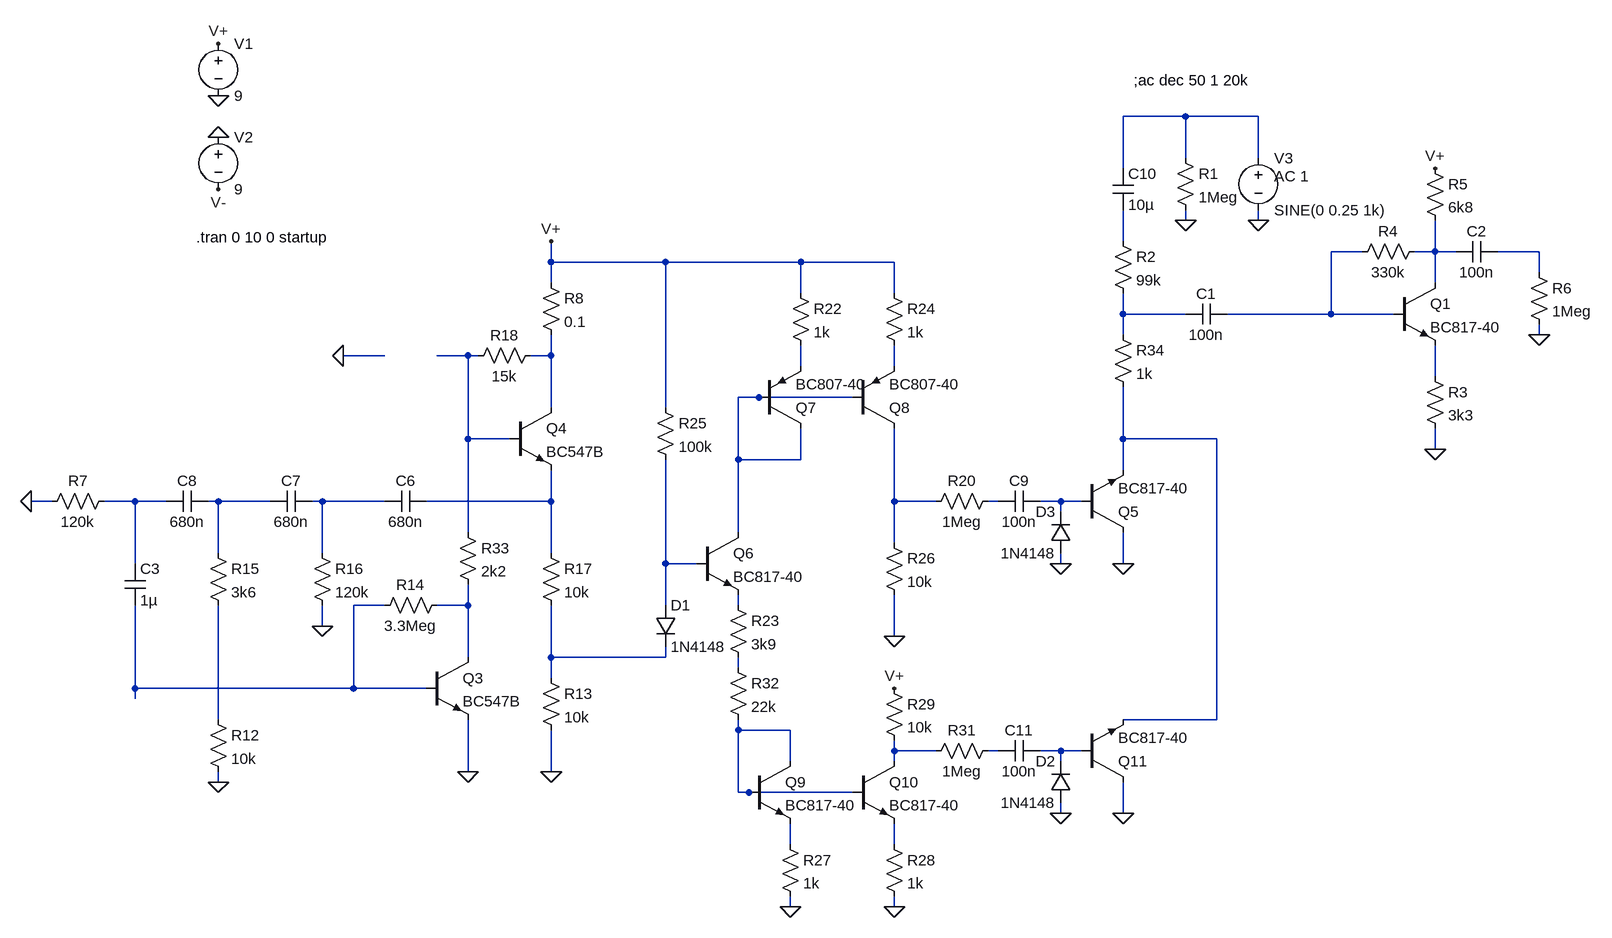
[diagram p0: schematic Draft15.asc]
Draft15.asc, the LTspice schematic file:
Version 4
SHEET 1 4440 680
WIRE 3808 -704 3712 -704
WIRE 3920 -704 3808 -704
WIRE 3808 -640 3808 -704
WIRE 3920 -640 3920 -704
WIRE 3712 -624 3712 -704
WIRE 3808 -544 3808 -560
WIRE 3920 -544 3920 -560
WIRE 3712 -512 3712 -560
WIRE 4080 -496 4032 -496
WIRE 4192 -496 4192 -544
WIRE 4192 -496 4160 -496
WIRE 4224 -496 4192 -496
WIRE 4352 -496 4288 -496
WIRE 2832 -480 2832 -512
WIRE 3008 -480 2832 -480
WIRE 3216 -480 3008 -480
WIRE 3360 -480 3216 -480
WIRE 4352 -464 4352 -496
WIRE 2832 -448 2832 -480
WIRE 4192 -448 4192 -496
WIRE 3216 -432 3216 -480
WIRE 3360 -432 3360 -480
WIRE 3712 -400 3712 -432
WIRE 3808 -400 3712 -400
WIRE 4032 -400 4032 -496
WIRE 4032 -400 3872 -400
WIRE 4128 -400 4032 -400
WIRE 3712 -368 3712 -400
WIRE 4352 -368 4352 -384
WIRE 2576 -336 2512 -336
WIRE 2704 -336 2656 -336
WIRE 2720 -336 2704 -336
WIRE 2832 -336 2832 -368
WIRE 2832 -336 2800 -336
WIRE 3216 -320 3216 -352
WIRE 3360 -320 3360 -352
WIRE 4192 -304 4192 -352
WIRE 3152 -272 3120 -272
WIRE 3296 -272 3152 -272
WIRE 2832 -256 2832 -336
WIRE 3008 -256 3008 -480
WIRE 2704 -208 2704 -336
WIRE 2768 -208 2704 -208
WIRE 3712 -208 3712 -288
WIRE 3856 -208 3712 -208
WIRE 4192 -192 4192 -224
WIRE 3120 -176 3120 -272
WIRE 3216 -176 3216 -224
WIRE 3216 -176 3120 -176
WIRE 3712 -160 3712 -208
WIRE 2064 -112 2032 -112
WIRE 2192 -112 2144 -112
WIRE 2240 -112 2192 -112
WIRE 2320 -112 2304 -112
WIRE 2400 -112 2320 -112
WIRE 2480 -112 2464 -112
WIRE 2576 -112 2480 -112
WIRE 2832 -112 2832 -160
WIRE 2832 -112 2640 -112
WIRE 3360 -112 3360 -224
WIRE 3424 -112 3360 -112
WIRE 3520 -112 3504 -112
WIRE 3616 -112 3584 -112
WIRE 3648 -112 3616 -112
WIRE 3616 -96 3616 -112
WIRE 2704 -64 2704 -208
WIRE 3120 -64 3120 -176
WIRE 3360 -48 3360 -112
WIRE 2320 -32 2320 -112
WIRE 2480 -32 2480 -112
WIRE 2832 -32 2832 -112
WIRE 2192 -16 2192 -112
WIRE 3008 -16 3008 -176
WIRE 3056 -16 3008 -16
WIRE 3616 -16 3616 -32
WIRE 3712 -16 3712 -64
WIRE 2576 48 2528 48
WIRE 2704 48 2704 16
WIRE 2704 48 2656 48
WIRE 3008 48 3008 -16
WIRE 3120 48 3120 32
WIRE 2480 80 2480 48
WIRE 3360 96 3360 32
WIRE 2704 128 2704 48
WIRE 2832 128 2832 48
WIRE 3008 128 3008 112
WIRE 3008 128 2832 128
WIRE 3120 144 3120 128
WIRE 2832 160 2832 128
WIRE 2192 176 2192 48
WIRE 2528 176 2528 48
WIRE 2528 176 2192 176
WIRE 2640 176 2528 176
WIRE 2192 192 2192 176
WIRE 2320 224 2320 48
WIRE 3856 224 3856 -208
WIRE 3856 224 3712 224
WIRE 3120 240 3120 224
WIRE 3200 240 3120 240
WIRE 3360 272 3360 256
WIRE 3424 272 3360 272
WIRE 3520 272 3504 272
WIRE 3616 272 3584 272
WIRE 3648 272 3616 272
WIRE 3200 288 3200 240
WIRE 3360 288 3360 272
WIRE 3616 288 3616 272
WIRE 2704 304 2704 224
WIRE 2832 304 2832 240
WIRE 2320 320 2320 304
WIRE 3120 336 3120 240
WIRE 3136 336 3120 336
WIRE 3296 336 3136 336
WIRE 3616 368 3616 352
WIRE 3712 368 3712 320
WIRE 3200 416 3200 384
WIRE 3360 416 3360 384
WIRE 3200 512 3200 496
WIRE 3360 512 3360 496
FLAG 2320 -736 0
FLAG 2320 -672 0
FLAG 2320 -816 V+
FLAG 2320 -592 V-
FLAG 2704 304 0
FLAG 2480 80 0
FLAG 2320 320 0
FLAG 2832 304 0
FLAG 2832 -512 V+
FLAG 2512 -336 0
FLAG 3712 -16 0
FLAG 3920 -544 0
FLAG 3360 96 0
FLAG 3200 512 0
FLAG 3360 512 0
FLAG 3360 176 V+
FLAG 3712 368 0
FLAG 3616 368 0
FLAG 3616 -16 0
FLAG 3808 -544 0
FLAG 4192 -192 0
FLAG 4192 -624 V+
FLAG 4352 -368 0
FLAG 2032 -112 0
SYMBOL voltage 2320 -832 R0
WINDOW 123 0 0 Left 0
WINDOW 39 0 0 Left 0
SYMATTR InstName V1
SYMATTR Value 9
SYMBOL voltage 2320 -688 R0
WINDOW 123 0 0 Left 0
WINDOW 39 0 0 Left 0
SYMATTR InstName V2
SYMATTR Value 9
SYMBOL npn 2640 128 R0
SYMATTR InstName Q3
SYMATTR Value BC547B
SYMBOL res 2672 32 R90
WINDOW 0 0 56 VBottom 2
WINDOW 3 32 56 VTop 2
SYMATTR InstName R14
SYMATTR Value 3.3Meg
SYMBOL cap 2640 -128 R90
WINDOW 0 0 32 VBottom 2
WINDOW 3 32 32 VTop 2
SYMATTR InstName C6
SYMATTR Value 680n
SYMBOL cap 2464 -128 R90
WINDOW 0 0 32 VBottom 2
WINDOW 3 32 32 VTop 2
SYMATTR InstName C7
SYMATTR Value 680n
SYMBOL cap 2304 -128 R90
WINDOW 0 0 32 VBottom 2
WINDOW 3 32 32 VTop 2
SYMATTR InstName C8
SYMATTR Value 680n
SYMBOL res 2304 -48 R0
SYMATTR InstName R15
SYMATTR Value 3k6
SYMBOL res 2464 -48 R0
SYMATTR InstName R16
SYMATTR Value 120k
SYMBOL res 2304 208 R0
SYMATTR InstName R12
SYMATTR Value 10k
SYMBOL npn 2768 -256 R0
SYMATTR InstName Q4
SYMATTR Value BC547B
SYMBOL res 2816 -48 R0
SYMATTR InstName R17
SYMATTR Value 10k
SYMBOL res 2816 -352 R90
WINDOW 0 0 56 VBottom 2
WINDOW 3 32 56 VTop 2
SYMATTR InstName R18
SYMATTR Value 15k
SYMBOL npn 3648 -64 M180
SYMATTR InstName Q5
SYMATTR Value BC817-40
SYMBOL cap 3584 -128 R90
WINDOW 0 0 32 VBottom 2
WINDOW 3 32 32 VTop 2
SYMATTR InstName C9
SYMATTR Value 100n
SYMBOL res 3520 -128 R90
WINDOW 0 0 56 VBottom 2
WINDOW 3 32 56 VTop 2
SYMATTR InstName R20
SYMATTR Value 1Meg
SYMBOL cap 3696 -624 R0
SYMATTR InstName C10
SYMATTR Value 10µ
SYMBOL voltage 3920 -656 R0
WINDOW 123 24 44 Left 2
WINDOW 39 0 0 Left 0
SYMATTR InstName V3
SYMATTR Value SINE(0 0.25 1k)
SYMATTR Value2 AC 1
SYMBOL npn 3056 -64 R0
SYMATTR InstName Q6
SYMATTR Value BC817-40
SYMBOL res 3104 32 R0
SYMATTR InstName R23
SYMATTR Value 3k9
SYMBOL res 2992 -272 R0
SYMATTR InstName R25
SYMATTR Value 100k
SYMBOL diode 2992 48 R0
SYMATTR InstName D1
SYMATTR Value 1N4148
SYMBOL res 2816 144 R0
SYMATTR InstName R13
SYMATTR Value 10k
SYMBOL pnp 3152 -224 M180
SYMATTR InstName Q7
SYMATTR Value BC807-40
SYMBOL pnp 3296 -224 M180
SYMATTR InstName Q8
SYMATTR Value BC807-40
SYMBOL res 3200 -448 R0
SYMATTR InstName R22
SYMATTR Value 1k
SYMBOL res 3344 -448 R0
SYMATTR InstName R24
SYMATTR Value 1k
SYMBOL res 3344 -64 R0
SYMATTR InstName R26
SYMATTR Value 10k
SYMBOL npn 3136 288 R0
SYMATTR InstName Q9
SYMATTR Value BC817-40
SYMBOL npn 3296 288 R0
SYMATTR InstName Q10
SYMATTR Value BC817-40
SYMBOL res 3184 400 R0
SYMATTR InstName R27
SYMATTR Value 1k
SYMBOL res 3344 400 R0
SYMATTR InstName R28
SYMATTR Value 1k
SYMBOL res 3344 160 R0
SYMATTR InstName R29
SYMATTR Value 10k
SYMBOL npn 3648 320 M180
SYMATTR InstName Q11
SYMATTR Value BC817-40
SYMBOL cap 3584 256 R90
WINDOW 0 0 32 VBottom 2
WINDOW 3 32 32 VTop 2
SYMATTR InstName C11
SYMATTR Value 100n
SYMBOL res 3520 256 R90
WINDOW 0 0 56 VBottom 2
WINDOW 3 32 56 VTop 2
SYMATTR InstName R31
SYMATTR Value 1Meg
SYMBOL res 3104 128 R0
SYMATTR InstName R32
SYMATTR Value 22k
SYMBOL res 2688 -80 R0
SYMATTR InstName R33
SYMATTR Value 2k2
SYMBOL diode 3632 352 R180
WINDOW 0 24 64 Left 2
WINDOW 3 24 0 Left 2
SYMATTR InstName D2
SYMATTR Value 1N4148
SYMBOL diode 3632 -32 R180
WINDOW 0 24 64 Left 2
WINDOW 3 24 0 Left 2
SYMATTR InstName D3
SYMATTR Value 1N4148
SYMBOL res 3696 -384 R0
SYMATTR InstName R34
SYMATTR Value 1k
SYMBOL res 3792 -656 R0
SYMATTR InstName R1
SYMATTR Value 1Meg
SYMBOL res 3696 -528 R0
SYMATTR InstName R2
SYMATTR Value 99k
SYMBOL cap 3872 -416 R90
WINDOW 0 0 32 VBottom 2
WINDOW 3 32 32 VTop 2
SYMATTR InstName C1
SYMATTR Value 100n
SYMBOL npn 4128 -448 R0
SYMATTR InstName Q1
SYMATTR Value BC817-40
SYMBOL res 4176 -320 R0
SYMATTR InstName R3
SYMATTR Value 3k3
SYMBOL res 4176 -512 R90
WINDOW 0 0 56 VBottom 2
WINDOW 3 32 56 VTop 2
SYMATTR InstName R4
SYMATTR Value 330k
SYMBOL res 4176 -640 R0
SYMATTR InstName R5
SYMATTR Value 6k8
SYMBOL cap 4288 -512 R90
WINDOW 0 0 32 VBottom 2
WINDOW 3 32 32 VTop 2
SYMATTR InstName C2
SYMATTR Value 100n
SYMBOL res 4336 -480 R0
SYMATTR InstName R6
SYMATTR Value 1Meg
SYMBOL res 2160 -128 R90
WINDOW 0 0 56 VBottom 2
WINDOW 3 32 56 VTop 2
SYMATTR InstName R7
SYMATTR Value 120k
SYMBOL cap 2176 -16 R0
SYMATTR InstName C3
SYMATTR Value 1µ
SYMBOL res 2816 -464 R0
SYMATTR InstName R8
SYMATTR Value 0.1
TEXT 2286 -518 Left 2 !.tran 0 10 0 startup
TEXT 3728 -760 Left 2 !;ac dec 50 1 20k

The netlist it stands for:
* Draft15.asc
V1 V+ 0 9
V2 0 V- 9
Q3 N023 N022 0 0 BC547B
R14 N023 N022 3.3Meg
C6 N017 N016 680n
C7 N016 N015 680n
C8 N015 N014 680n
R15 N015 N027 3k6
R16 N016 0 120k
R12 N027 0 10k
Q4 N008 N007 N017 0 BC547B
R17 N017 N025 10k
R18 N008 N007 15k
Q5 0 N020 N013 0 BC817-40
C9 N020 N019 100n
R20 N019 N018 1Meg
C10 N001 N002 10µ
V3 N001 0 SINE(0 0.25 1k) AC 1
Q6 N012 N021 N024 0 BC817-40
R23 N024 N026 3k9
R25 V+ N021 100k
D1 N021 N025 1N4148
R13 N025 0 10k
Q7 N012 N012 N009 0 BC807-40
Q8 N018 N012 N010 0 BC807-40
R22 V+ N009 1k
R24 V+ N010 1k
R26 N018 0 10k
Q9 N028 N028 N032 0 BC817-40
Q10 N029 N028 N033 0 BC817-40
R27 N032 0 1k
R28 N033 0 1k
R29 V+ N029 10k
Q11 0 N031 N013 0 BC817-40
C11 N031 N030 100n
R31 N030 N029 1Meg
R32 N026 N028 22k
R33 N007 N023 2k2
D2 0 N031 1N4148
D3 0 N020 1N4148
R34 N006 N013 1k
R1 N001 0 1Meg
R2 N002 N006 99k
C1 N003 N006 100n
Q1 N004 N003 N011 0 BC817-40
R3 N011 0 3k3
R4 N004 N003 330k
R5 V+ N004 6k8
C2 N005 N004 100n
R6 N005 0 1Meg
R7 N014 0 120k
C3 N014 N022 1µ
R8 V+ N008 0.1
.model D D
.lib standard.dio
.model NPN NPN
.model PNP PNP
.lib standard.bjt
.tran 0 10 0 startup
;ac dec 50 1 20k
.backanno
.end